# EAGLE design Board_2 (EAGLE 9.0.1)
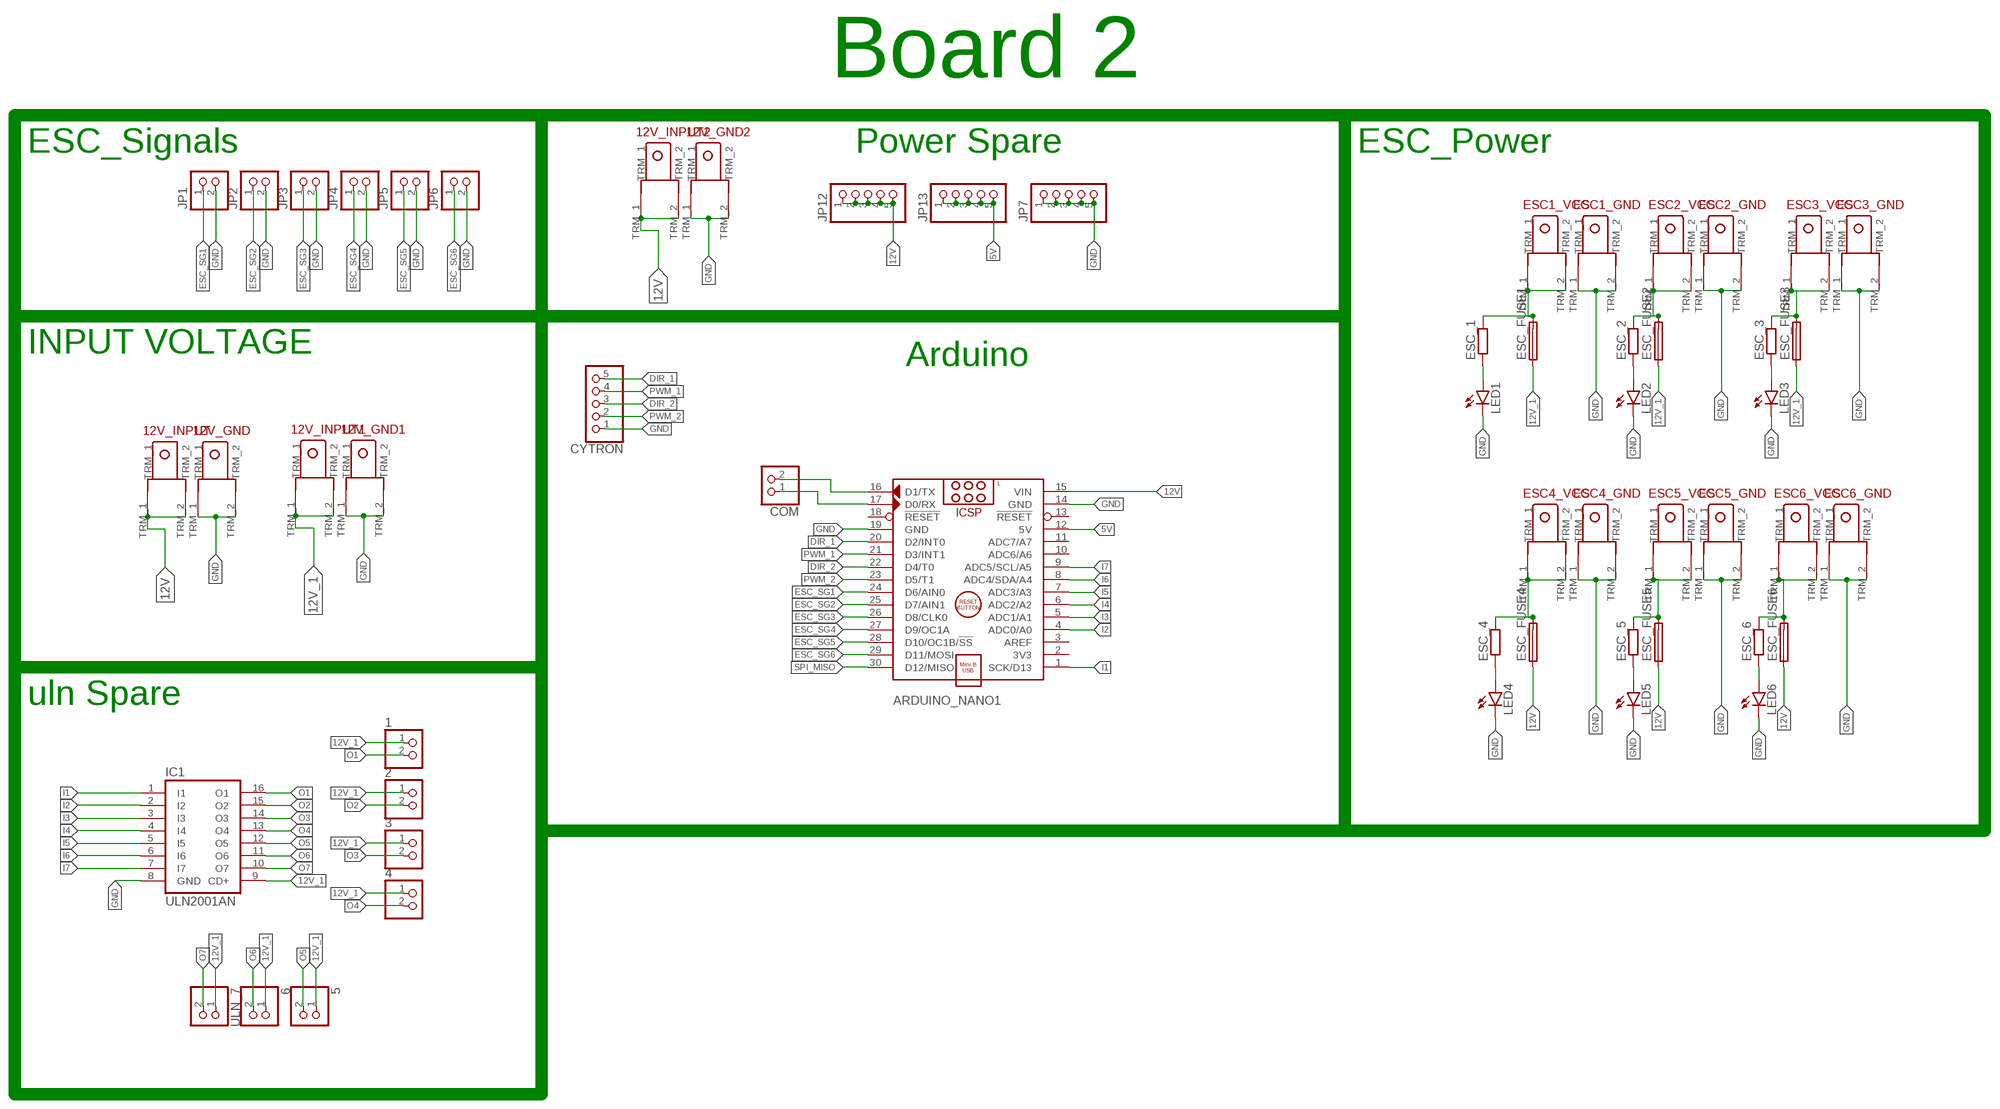
[diagram p0: schematic, sheet 1]

## Parts
1  PINHD-1X2  [1X02]
2  PINHD-1X2  [1X02]
3  PINHD-1X2  [1X02]
4  PINHD-1X2  [1X02]
5  PINHD-1X2  [1X02]
6  PINHD-1X2  [1X02]
12V_GND  TERMINAL_EDITED  [TERMINAL_EDITED]
12V_GND1  TERMINAL_EDITED  [TERMINAL_EDITED]
12V_GND2  TERMINAL_EDITED  [TERMINAL_EDITED]
12V_INPUT  TERMINAL_EDITED  [TERMINAL_EDITED]
12V_INPUT1  TERMINAL_EDITED  [TERMINAL_EDITED]
12V_INPUT2  TERMINAL_EDITED  [TERMINAL_EDITED]
ARDUINO_NANO1  ARDUINO_NANO  [ARDUINO_NANO]
COM  PINHD-1X2  [1X02]
CYTRON  PINHD-1X5  [1X05]
ESC1_GND  TERMINAL_EDITED  [TERMINAL_EDITED]
ESC1_VCC  TERMINAL_EDITED  [TERMINAL_EDITED]
ESC2_GND  TERMINAL_EDITED  [TERMINAL_EDITED]
ESC2_VCC  TERMINAL_EDITED  [TERMINAL_EDITED]
ESC3_GND  TERMINAL_EDITED  [TERMINAL_EDITED]
ESC3_VCC  TERMINAL_EDITED  [TERMINAL_EDITED]
ESC4_GND  TERMINAL_EDITED  [TERMINAL_EDITED]
ESC4_VCC  TERMINAL_EDITED  [TERMINAL_EDITED]
ESC5_GND  TERMINAL_EDITED  [TERMINAL_EDITED]
ESC5_VCC  TERMINAL_EDITED  [TERMINAL_EDITED]
ESC6_GND  TERMINAL_EDITED  [TERMINAL_EDITED]
ESC6_VCC  TERMINAL_EDITED  [TERMINAL_EDITED]
ESC_1  RESISTOR  [0207/10]
ESC_2  RESISTOR  [0207/10]
ESC_3  RESISTOR  [0207/10]
ESC_4  RESISTOR  [0207/10]
ESC_5  RESISTOR  [0207/10]
ESC_6  RESISTOR  [0207/10]
ESC_FUSE1  FUSE  [SH22,5A]
ESC_FUSE2  FUSE  [SH22,5A]
ESC_FUSE3  FUSE  [SH22,5A]
ESC_FUSE4  FUSE  [SH22,5A]
ESC_FUSE5  FUSE  [SH22,5A]
ESC_FUSE6  FUSE  [SH22,5A]
IC1  ULN2001AN  [DIL16]
JP1  PINHD-1X2  [1X02]
JP2  PINHD-1X2  [1X02]
JP3  PINHD-1X2  [1X02]
JP4  PINHD-1X2  [1X02]
JP5  PINHD-1X2  [1X02]
JP6  PINHD-1X2  [1X02]
JP7  PINHD-1X5  [1X05]
JP12  PINHD-1X5  [1X05]
JP13  PINHD-1X5  [1X05]
LED1  LED5MM  [LED5MM]
LED2  LED5MM  [LED5MM]
LED3  LED5MM  [LED5MM]
LED4  LED5MM  [LED5MM]
LED5  LED5MM  [LED5MM]
LED6  LED5MM  [LED5MM]
ULN_7  PINHD-1X2  [1X02]

## Nets
5V: ARDUINO_NANO1.12(5V) JP13.1 JP13.2 JP13.3 JP13.4 JP13.5
12V: 12V_INPUT2.TRM_1 12V_INPUT2.TRM_2 12V_INPUT.TRM_1 12V_INPUT.TRM_2 ARDUINO_NANO1.15(VIN) ESC_FUSE4.1 ESC_FUSE5.1 ESC_FUSE6.1 JP12.1 JP12.2 JP12.3 JP12.4 JP12.5
12V_1: 1.1 2.1 3.1 4.1 5.1 6.1 12V_INPUT1.TRM_1 12V_INPUT1.TRM_2 ESC_FUSE1.1 ESC_FUSE2.1 ESC_FUSE3.1 IC1.9(CD+) ULN_7.1
DIR_1: ARDUINO_NANO1.20(D2/INT0) CYTRON.5
DIR_2: ARDUINO_NANO1.22(D4/T0) CYTRON.3
ESC_SG1: ARDUINO_NANO1.24(D6/AIN0) JP1.1
ESC_SG2: ARDUINO_NANO1.25(D7/AIN1) JP2.1
ESC_SG3: ARDUINO_NANO1.26(D8/CLK0) JP3.1
ESC_SG4: ARDUINO_NANO1.27(D9/OC1A) JP4.1
ESC_SG5: ARDUINO_NANO1.28(D10/OC1B/!SS) JP5.1
ESC_SG6: ARDUINO_NANO1.29(D11/MOSI) JP6.1
GND: 12V_GND1.TRM_1 12V_GND1.TRM_2 12V_GND2.TRM_1 12V_GND2.TRM_2 12V_GND.TRM_1 12V_GND.TRM_2 ARDUINO_NANO1.14(GND) ARDUINO_NANO1.19(GND) CYTRON.1 ESC1_GND.TRM_1 ESC1_GND.TRM_2 ESC2_GND.TRM_1 ESC2_GND.TRM_2 ESC3_GND.TRM_1 ESC3_GND.TRM_2 ESC4_GND.TRM_1 ESC4_GND.TRM_2 ESC5_GND.TRM_1 ESC5_GND.TRM_2 ESC6_GND.TRM_1 ESC6_GND.TRM_2 IC1.8(GND) JP1.2 JP2.2 JP3.2 JP4.2 JP5.2 JP6.2 JP7.1 JP7.2 JP7.3 JP7.4 JP7.5 LED1.K(C) LED2.K(C) LED3.K(C) LED4.K(C) LED5.K(C) LED6.K(C)
I1: ARDUINO_NANO1.1(SCK/D13) IC1.1(I1)
I2: ARDUINO_NANO1.4(ADC0/A0) IC1.2(I2)
I3: ARDUINO_NANO1.5(ADC1/A1) IC1.3(I3)
I4: ARDUINO_NANO1.6(ADC2/A2) IC1.4(I4)
I5: ARDUINO_NANO1.7(ADC3/A3) IC1.5(I5)
I6: ARDUINO_NANO1.8(ADC4/SDA/A4) IC1.6(I6)
I7: ARDUINO_NANO1.9(ADC5/SCL/A5) IC1.7(I7)
N$1: ESC1_VCC.TRM_1 ESC1_VCC.TRM_2 ESC_1.2 ESC_FUSE1.2
N$4: ESC2_VCC.TRM_1 ESC2_VCC.TRM_2 ESC_2.2 ESC_FUSE2.2
N$5: ARDUINO_NANO1.17(D0/RX) COM.1
N$6: ARDUINO_NANO1.16(D1/TX) COM.2
N$7: ESC3_VCC.TRM_1 ESC3_VCC.TRM_2 ESC_3.2 ESC_FUSE3.2
N$10: ESC4_VCC.TRM_1 ESC4_VCC.TRM_2 ESC_4.2 ESC_FUSE4.2
N$11: ESC_1.1 LED1.A
N$13: ESC5_VCC.TRM_1 ESC5_VCC.TRM_2 ESC_5.2 ESC_FUSE5.2
N$14: ESC_2.1 LED2.A
N$16: ESC6_VCC.TRM_1 ESC6_VCC.TRM_2 ESC_6.2 ESC_FUSE6.2
N$17: ESC_3.1 LED3.A
N$19: ESC_4.1 LED4.A
N$21: ESC_5.1 LED5.A
N$23: ESC_6.1 LED6.A
O1: 1.2 IC1.16(O1)
O2: 2.2 IC1.15(O2)
O3: 3.2 IC1.14(O3)
O4: 4.2 IC1.13(O4)
O5: 5.2 IC1.12(O5)
O6: 6.2 IC1.11(O6)
O7: IC1.10(O7) ULN_7.2
PWM_1: ARDUINO_NANO1.21(D3/INT1) CYTRON.4
PWM_2: ARDUINO_NANO1.23(D5/T1) CYTRON.2
SPI_MISO: ARDUINO_NANO1.30(D12/MISO)
Unconnected: ARDUINO_NANO1.2(3V3) ARDUINO_NANO1.3(AREF) ARDUINO_NANO1.10(ADC6/A6) ARDUINO_NANO1.11(ADC7/A7) ARDUINO_NANO1.13(!RESET) ARDUINO_NANO1.18(!RESET)

## Notes on the sheet
- Board 2
- ESC_Signals | Power Spare | ESC_Power
- INPUT VOLTAGE
- Arduino
- uln Spare

## Library data of the parts
1-6 COM JP1-JP6 ULN_7 = pinhead:PINHD-1X2: PIN HEADER
12V_GND 12V_GND1 12V_GND2 12V_INPUT 12V_INPUT1 12V_INPUT2 ESC1_GND ESC1_VCC ESC2_GND ESC2_VCC ESC3_GND ESC3_VCC ESC4_GND ESC4_VCC ESC5_GND ESC5_VCC ESC6_GND ESC6_VCC = 1-ROV Components:TERMINAL_EDITED
ARDUINO_NANO1 = 1-ROV Components:ARDUINO_NANO: Arduino Nano V3.0 Module Overview: The Arduino Nano is a small, complete, and breadboard-friendly board based on the ATmega328 (Arduino Nano 3.x) or ATmega168 (Arduino Nano 2.x). It has more or less the same functionality of the Arduino Duemilanove, but in a different package. It lacks only a DC power jack, and works with a Mini-B USB cable instead of a standard one. The Nano was designed and is being produced by Gravitech <http://www.gravitech.us/arna30wiatp.html>. General specifications: Item Value Microcontroller Atmel ATmega168 or ATmega328 Operating Voltage (logic level) 5 V Input Voltage (recommended) 7-12 V Input Voltage (limits) 6-20 V Digital I/O Pins 14 (of which 6 provide PWM output) Analog Input Pins 8 DC Current per I/O Pin 40 mA Flash Memory 16 KB (ATmega168) or 32 KB (ATmega328) of which 2 KB used by bootloader SRAM 1 KB (ATmega168) or 2 KB (ATmega328) EEPROM 512 bytes (ATmega168) or 1 KB (ATmega328) Clock Speed 16 MHz Dimensions (Inches) 0.73" x 1.70" Dimensions (mm) 18mm x 45mm Overall height About 9 mm (not including pins) Weigth 5 g Power: The Arduino Nano can be powered via the Mini-B USB connection, 6-20V unregulated external power supply (pin 30), or 5V regulated external power supply (pin 27). The power source is automatically selected to the highest voltage source. Memory: The ATmega168 has 16 KB of flash memory for storing code (of which 2 KB is used for the bootloader); the ATmega328 has 32 KB, (also with 2 KB used for the bootloader). The ATmega168 has 1 KB of SRAM and 512 bytes of EEPROM (which can be read and written with the EEPROM library); the ATmega328 has 2 KB of SRAM and 1 KB of EEPROM. Input and Output: Each of the 14 digital pins on the Nano can be used as an input or output, using pinMode(), digitalWrite(), and digitalRead() functions. They operate at 5 volts. Each pin can provide or receive a maximum of 40 mA and has an internal pull-up resistor (disconnected by default) of 20-50 kOhms. In addition, some pins have specialized functions. Visit Arduino - ArduinoBoardNano <https://www.arduino.cc/en/Main/ArduinoBoardNano>
CYTRON JP7 JP12 JP13 = pinhead:PINHD-1X5: PIN HEADER
ESC_1-ESC_6 = 1-ROV Components:RESISTOR
ESC_FUSE1-ESC_FUSE6 = 1-ROV Components:FUSE
IC1 = uln-udn:ULN2001A: DRIVER ARRAY
LED1-LED6 = led:LED: LED OSRAM: - CHIPLED LG R971, LG N971, LY N971, LG Q971, LY Q971, LO R971, LY R971 LH N974, LH R974 LS Q976, LO Q976, LY Q976 LO Q996 - Hyper CHIPLED LW Q18S LB Q993, LB Q99A, LB R99A - SideLED LS A670, LO A670, LY A670, LG A670, LP A670 LB A673, LV A673, LT A673, LW A673 LH A674 LY A675 LS A676, LA A676, LO A676, LY A676, LW A676 LS A679, LY A679, LG A679 - Hyper Micro SIDELED® LS Y876, LA Y876, LO Y876, LY Y876 LT Y87S - SmartLED LW L88C, LW L88S LB L89C, LB L89S, LG L890 LS L89K, LO L89K, LY L89K LS L896, LA L896, LO L896, LY L896 - TOPLED LS T670, LO T670, LY T670, LG T670, LP T670 LSG T670, LSP T670, LSY T670, LOP T670, LYG T670 LG T671, LOG T671, LSG T671 LB T673, LV T673, LT T673, LW T673 LH T674 LS T676, LA T676, LO T676, LY T676, LB T676, LH T676, LSB T676, LW T676 LB T67C, LV T67C, LT T67C, LS T67K, LO T67K, LY T67K, LW E67C LS E67B, LA E67B, LO E67B, LY E67B, LB E67C, LV E67C, LT E67C LW T67C LS T679, LY T679, LG T679 LS T770, LO T770, LY T770, LG T770, LP T770 LB T773, LV T773, LT T773, LW T773 LH T774 LS E675, LA E675, LY E675, LS T675 LS T776, LA T776, LO T776, LY T776, LB T776 LHGB T686 LT T68C, LB T68C - Hyper Mini TOPLED® LB M676 - Mini TOPLED Santana® LG M470 LS M47K, LO M47K, LY M47K Source: http://www.osram.convergy.de LUXEON: - LUMILED® LXK2-PW12-R00, LXK2-PW12-S00, LXK2-PW14-U00, LXK2-PW14-V00 LXK2-PM12-R00, LXK2-PM12-S00, LXK2-PM14-U00 LXK2-PE12-Q00, LXK2-PE12-R00, LXK2-PE12-S00, LXK2-PE14-T00, LXK2-PE14-U00 LXK2-PB12-K00, LXK2-PB12-L00, LXK2-PB12-M00, LXK2-PB14-N00, LXK2-PB14-P00, LXK2-PB14-Q00 LXK2-PR12-L00, LXK2-PR12-M00, LXK2-PR14-Q00, LXK2-PR14-R00 LXK2-PD12-Q00, LXK2-PD12-R00, LXK2-PD12-S00 LXK2-PH12-R00, LXK2-PH12-S00 LXK2-PL12-P00, LXK2-PL12-Q00, LXK2-PL12-R00 Source: www.luxeon.com KINGBRIGHT: KA-3528ASYC Source: www.kingbright.com

## Board
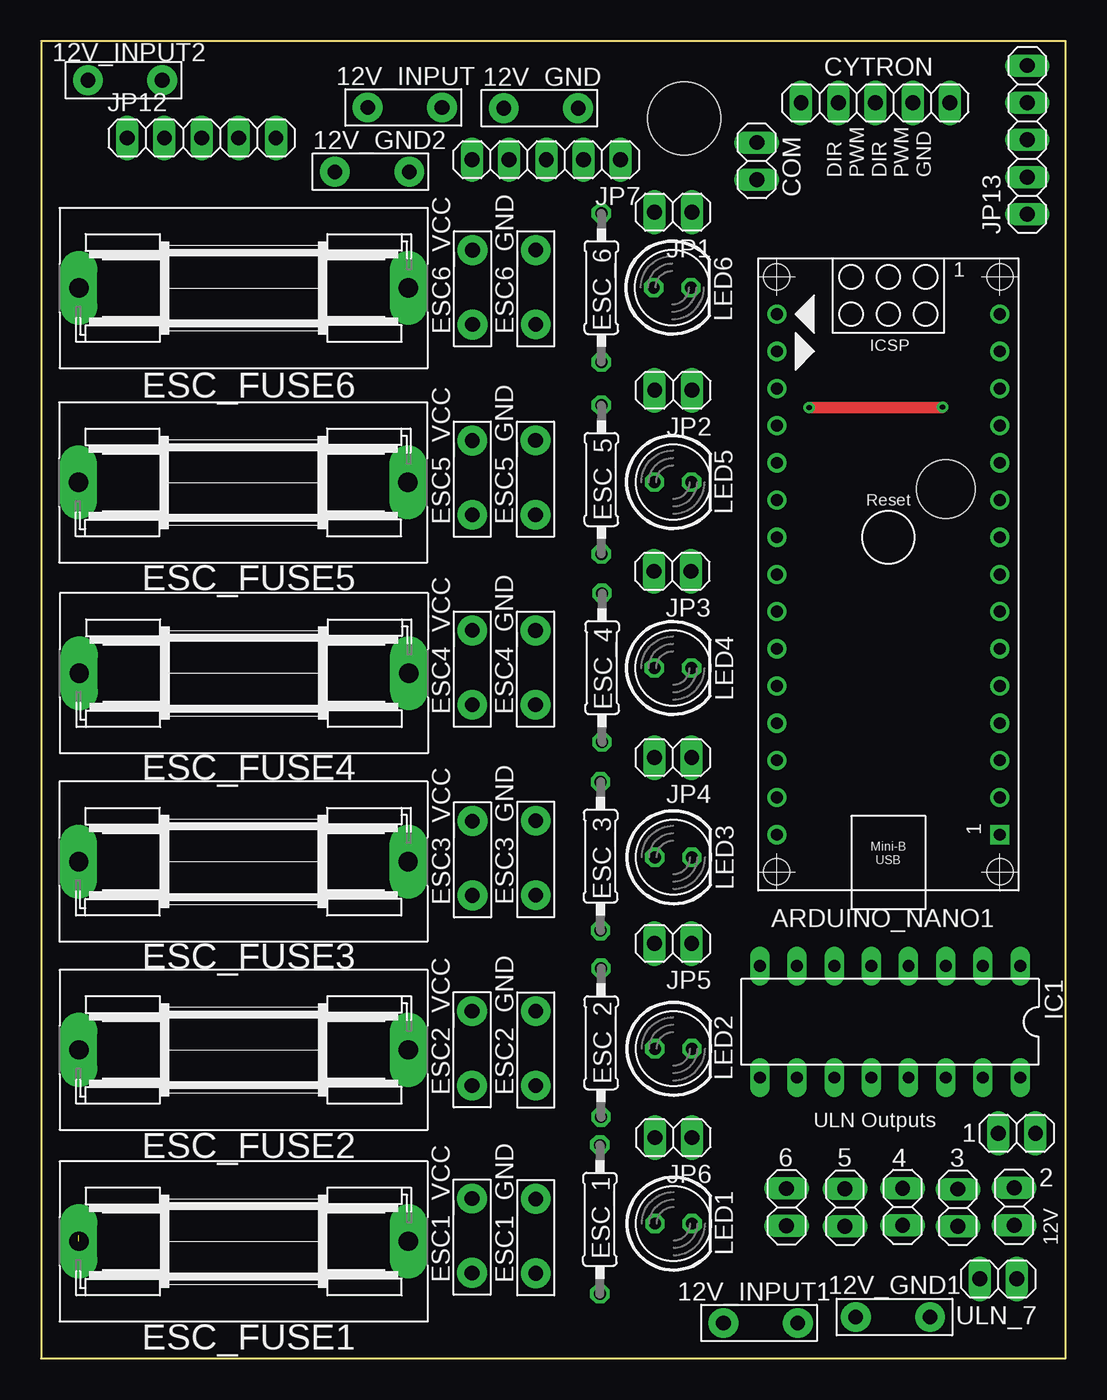
[diagram p1: board, top side]
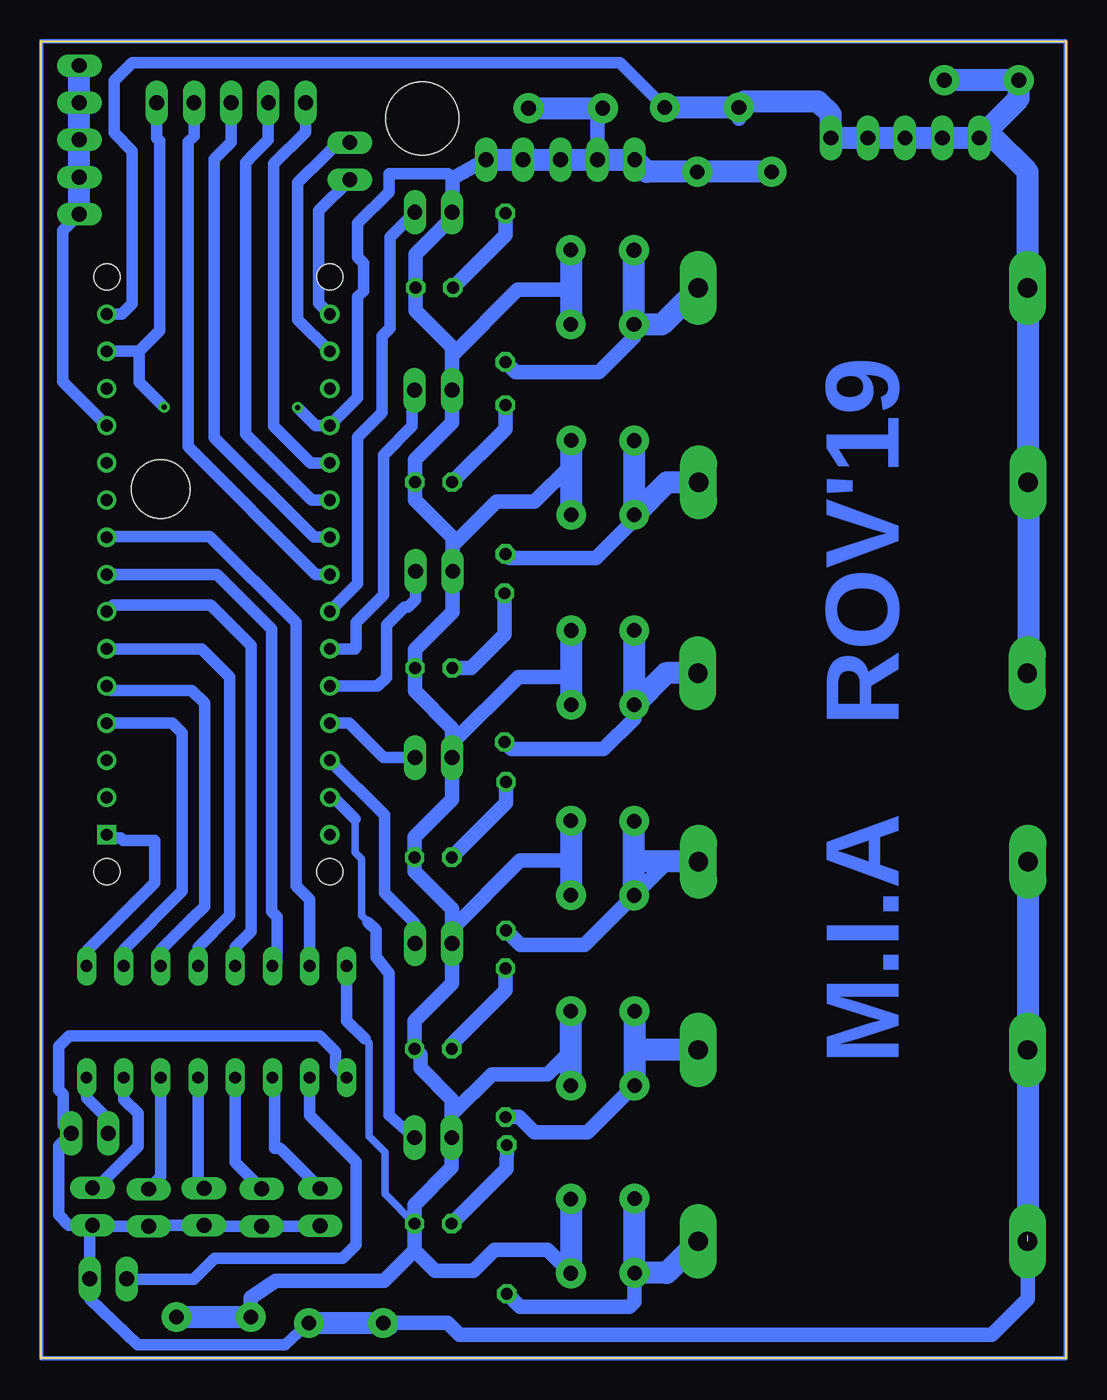
[diagram p2: board, bottom side, seen from below]

Size 70 x 90 mm. Coordinates in mm from the lower left corner, seen from the top.
Outline: 0,0 70,0 70,90 0,90 0,0
Copper layers (1*16): Top 0.035mm / dielectric 1.5mm / Bottom 0.035mm
Design rules "default": minimum track width 6mil, minimum drill 0.35mm, track to track 6mil, track to pad 6mil, pad to pad 6mil, via to via 6mil, smd to smd 6mil, copper to edge 40mil, drill to drill 6mil, minimum pad ring 10mil, minimum via ring 8mil, stop-mask expansion 4mil, vias tented up to drill 0mil, thermal gap 10mil
Holes 5 mm at 43.94,84.71
Holes 4 mm at 61.82,59.39

### Footprints (pad centres in the part's own frame; a part is rotated, then mirrored left to right if it is on the bottom)
1X02 = drill 1.016 long: 1 -1.27,0; 2 1.27,0
TERMINAL_EDITED = drill 1 pad 2.032: TRM_1 -2.54,0; TRM_2 2.54,0
ARDUINO_NANO = drill 0.8 square: 1 -20.32,-7.62 | drill 0.8: 2 -17.78,-7.62; 3 -15.24,-7.62; 4 -12.7,-7.62; 5 -10.16,-7.62; 6 -7.62,-7.62; 7 -5.08,-7.62; 8 -2.54,-7.62; 9 0,-7.62; 10 2.54,-7.62; 11 5.08,-7.62; 12 7.62,-7.62; 13 10.16,-7.62; 14 12.7,-7.62; 15 15.24,-7.62; 16 15.24,7.62; 17 12.7,7.62; 18 10.16,7.62; 19 7.62,7.62; 20 5.08,7.62; 21 2.54,7.62; 22 0,7.62; 23 -2.54,7.62; 24 -5.08,7.62; 25 -7.62,7.62; 26 -10.16,7.62; 27 -12.7,7.62; 28 -15.24,7.62; 29 -17.78,7.62; 30 -20.32,7.62 | hole 1.778: -22.86,-7.62; -22.86,7.62; 17.78,7.62; 17.78,-7.62
1X05 = drill 1.016 long: 1 -5.08,0; 2 -2.54,0; 3 0,0; 4 2.54,0; 5 5.08,0
0207/10 = drill 0.813 octagon: 1 -5.08,0; 2 5.08,0
SH22,5A = drill 1.321 pad 2.54 long: 1 -11.252,0; 2 11.252,0
DIL16 = drill 0.813 long: 1 -8.89,-3.81; 2 -6.35,-3.81; 3 -3.81,-3.81; 4 -1.27,-3.81; 5 1.27,-3.81; 6 3.81,-3.81; 7 6.35,-3.81; 8 8.89,-3.81; 9 8.89,3.81; 10 6.35,3.81; 11 3.81,3.81; 12 1.27,3.81; 13 -1.27,3.81; 14 -3.81,3.81; 15 -6.35,3.81; 16 -8.89,3.81
LED5MM = drill 0.813 octagon: A -1.27,0; K 1.27,0

### Placement (x,y rotation side)
1  66.67,15.39 180 top
2  66.48,10.38 90 top
3  62.64,10.3 90 top
4  58.87,10.36 90 top
5  54.93,10.31 90 top
6  50.94,10.34 90 top
12V_GND  34.15,85.41 0 top
12V_GND1  58.2,2.83 180 top
12V_GND2  22.62,81.07 0 top
12V_INPUT  24.86,85.46 0 top
12V_INPUT1  49.16,2.43 0 top
12V_INPUT2  5.74,87.32 0 top
ARDUINO_NANO1  57.89,56.1 90 top
COM  48.9,81.8 270 top
CYTRON  57.01,85.77 180 top
ESC1_GND  33.8,8.36 90 top
ESC1_VCC  29.45,8.39 90 top
ESC2_GND  33.8,21.18 90 top
ESC2_VCC  29.45,21.19 90 top
ESC3_GND  33.8,34.2 90 top
ESC3_VCC  29.48,34.17 90 top
ESC4_GND  33.78,47.19 90 top
ESC4_VCC  29.47,47.2 90 top
ESC5_GND  33.78,60.17 90 top
ESC5_VCC  29.47,60.17 90 top
ESC6_GND  33.81,73.18 90 top
ESC6_VCC  29.49,73.17 90 top
ESC_1  38.18,9.5 270 top
ESC_2  38.26,21.57 270 top
ESC_3  38.23,34.32 270 top
ESC_4  38.33,47.19 270 top
ESC_5  38.28,60.05 270 top
ESC_6  38.28,73.15 270 top
ESC_FUSE1  13.84,8 0 top
ESC_FUSE2  13.84,21.08 0 top
ESC_FUSE3  13.83,33.94 0 top
ESC_FUSE4  13.87,46.81 0 top
ESC_FUSE5  13.82,59.84 0 top
ESC_FUSE6  13.84,73.13 0 top
IC1  58,23 180 top
JP1  43.19,78.31 180 top
JP2  43.2,66.14 180 top
JP3  43.14,53.77 180 top
JP4  43.18,41.05 180 top
JP5  43.18,28.35 180 top
JP6  43.21,15.09 180 top
JP7  34.52,81.89 180 top
JP12  10.97,83.37 0 top
JP13  67.38,83.25 90 top
LED1  43.21,9.21 0 top
LED2  43.21,21.16 0 top
LED3  43.21,34.24 0 top
LED4  43.17,47.17 0 top
LED5  43.18,59.87 0 top
LED6  43.13,73.15 0 top
ULN_7  65.4,5.43 180 top

### Tracks (layer width: path | path; a pad name or v marks a point on that pad's centre or on a via)
5V
  Bottom 0.8: ARDUINO_NANO1.12 68.51,66.72 68.51,77.04 JP13.1
  Bottom 1: JP13.1 JP13.2 JP13.3 | 67.44,82.65 67.28,82.49 JP13.3 | JP13.3 JP13.4 67.38,88.16 JP13.5
  Bottom 1.5: JP13.1 67.38,88.16
12V
  Bottom 0.8: ARDUINO_NANO1.15 64.47,71.34 63.75,72.06 63.75,82.47 65,83.72 65,87.3 63.78,88.52 30.45,88.52 12V_INPUT.TRM_2
  Bottom 1: 2.59,60 2.59,58.41 | 2.59,58.41 3,58 | 2.59,58.41 2.56,58.44 ESC_FUSE5.1 | 2.56,46.86 ESC_FUSE4.1 | 22.07,85.71 12V_INPUT.TRM_1 22.32,84.69
  Bottom 1.5: 12V_INPUT.TRM_2 12V_INPUT.TRM_1 21.93,85.85 16.92,85.85 16.05,84.98 JP12.5 JP12.4 JP12.3 JP12.2 JP12.1 | 2.59,60 ESC_FUSE6.1 2.59,81.06 4.9,83.37 JP12.1 | ESC_FUSE5.1 2.56,46.86 | JP12.1 3.2,86.06 12V_INPUT2.TRM_1 12V_INPUT2.TRM_2
12V_1  (1 unrouted)
  Bottom 0.8: 6.1 50.96,9.04 5.1 58.81,9.04 4.1 62.58,9.09 3.1 66.41,9.03 | 66.41,9.03 2.1 68.09,9.11 68.78,9.8 68.78,14.54 1.1 68.48,15.93 68.48,18.03 68.78,18.34 68.78,21.34 68.07,22.05 50.98,22.05 49.89,20.95 49.89,19.97 IC1.9 | 66.41,9.03 66.67,8.76 ULN_7.1 66.67,4.09 63.4,0.94 53.32,0.94 51.91,2.22
  Bottom 1: 51.91,2.22 12V_INPUT1.TRM_2 | 46.11,2.11 46.43,2.43 | ESC_FUSE1.1 2.59,4.06 5.03,1.63 41.4,1.63 42.21,2.43 12V_INPUT1.TRM_1 | 2.59,8.41 3,8
  Bottom 1.5: 12V_INPUT1.TRM_2 12V_INPUT1.TRM_1 46.43,2.43 | ESC_FUSE3.1 2.58,21.1 ESC_FUSE2.1 ESC_FUSE1.1
DIR_1
  Bottom 0.8: ARDUINO_NANO1.20 51.58,61.18 54.1,63.7 54.1,81.61 51.93,83.78 CYTRON.5
DIR_2
  Bottom 0.8: ARDUINO_NANO1.22 51.35,56.1 58.17,62.92 58.17,81.94 57.01,83.1 CYTRON.3
ESC_SG1
  Bottom 0.8: ARDUINO_NANO1.24 48.36,52.93 48.36,54 48.36,54.74 48.36,62.94 46.69,64.62 46.69,69.85 46.15,70.38 46.15,76.61 JP1.1
ESC_SG2
  Bottom 0.8: ARDUINO_NANO1.25 48.55,48.48 48.46,48.56 48.46,50.29 46.61,52.15 46.61,61.72 44.65,63.68 44.65,65.95 JP2.1
ESC_SG3
  Bottom 0.8: ARDUINO_NANO1.26 47,45.94 46.41,46.53 46.41,50.09 45.16,51.33 44.91,51.33 44.41,51.83 JP3.1
ESC_SG4
  Bottom 0.8: JP4.1 46.58,41.05 48.94,43.4 ARDUINO_NANO1.27
ESC_SG5
  Bottom 0.8: JP5.1 44.45,29.72 46.53,31.8 46.53,37.12 ARDUINO_NANO1.28
ESC_SG6
  Bottom 0.508: 47.65,29.79 48.11,30.25 48.11,34.13 48.54,34.56 48.54,36.85
  Bottom 0.8: JP6.1 46.23,16.61 46.23,26.31 47.12,27.43 47.12,29.26 47.65,29.79 | ARDUINO_NANO1.29 50,38.32 48.54,36.85
GND  (via drill 0.35)
  Top 0.8: v52.48,64.95 61.54,64.95 v61.59,65
  Bottom 0.508: 47.85,21.82 47.6,21.57 47.6,15.16 46.51,14.07 46.51,11.24 LED1.K
  Bottom 0.8: 41.87,80.62 42.17,80.92 46.23,80.92 46.23,79.68 48.36,77.55 48.36,75.23 47.97,74.83 47.97,72.92 48.36,72.53 48.36,65.63 ARDUINO_NANO1.19 51.25,63.72 v52.48,64.95 | IC1.8 49.11,23.07 47.85,21.82 | ARDUINO_NANO1.14 63.3,68.8 | 63.3,68.8 61.9,70.21 61.9,83.19 62.09,83.38 CYTRON.1 | v61.59,65 63.3,66.71 63.3,68.8
  Bottom 1: ESC2_GND.TRM_1 33.8,21.01 | 33.8,21.01 ESC2_GND.TRM_2 | ESC1_GND.TRM_1 35.4,7.42 39.01,7.42 40.44,5.99 43.08,5.99 44.48,7.4 | 44.48,7.4 LED1.K 44.48,10.51 41.94,13.06 JP6.2 41.94,16.66 | 33.8,21.01 35.4,19.41 39.19,19.41 41.94,16.66 | 41.94,16.66 41.94,17.7 44.07,19.84 44.07,20.75 LED2.K 44.48,23.06 41.91,25.63 JP5.2 | ESC3_GND.TRM_2 33.8,34.01 | 33.8,34.01 ESC3_GND.TRM_1 | 33.8,34.01 37.26,34.01 41.91,29.36 JP5.2 | JP5.2 41.91,30.71 44.48,33.27 LED3.K 44.48,35.64 41.91,38.2 JP4.2 | ESC4_GND.TRM_2 33.78,47 | 33.78,47 ESC4_GND.TRM_1 | 33.78,47 34.22,46.56 37.39,46.56 41.91,42.04 JP4.2 | JP4.2 41.91,43.05 44.44,45.59 LED4.K 44.44,48.42 41.87,50.99 JP3.2 | ESC5_GND.TRM_2 33.78,61.01 | 33.78,61.01 ESC5_GND.TRM_1 | 33.78,61.01 36.27,58.52 38.89,58.52 41.87,55.54 JP3.2 | JP3.2 41.87,56.07 44.45,58.65 LED5.K 44.45,61.42 41.93,63.94 JP2.2 | ESC6_GND.TRM_2 33.81,73 | 33.81,73 ESC6_GND.TRM_1 | 33.81,73 37.44,73 41.93,68.51 JP2.2 | JP2.2 41.93,69.1 44.4,71.58 LED6.K 44.4,75.44 41.87,77.97 JP1.2 41.87,80.62 JP7.1 JP7.2 JP7.3 JP7.4 | JP7.4 JP7.5 | 12V_GND.TRM_1 31.98,85.05 JP7.4 | 12V_GND1.TRM_2 55.66,4.15 53.97,5.31 46.57,5.31 44.48,7.4
  Bottom 1.5: 12V_GND.TRM_2 12V_GND.TRM_1 | JP7.1 JP7.5 28.62,81.07 12V_GND2.TRM_2 12V_GND2.TRM_1 | ESC1_GND.TRM_2 ESC1_GND.TRM_1 | ESC2_GND.TRM_1 ESC2_GND.TRM_2 | ESC3_GND.TRM_2 ESC3_GND.TRM_1 | ESC4_GND.TRM_2 ESC4_GND.TRM_1 | ESC5_GND.TRM_2 ESC5_GND.TRM_1 | ESC6_GND.TRM_2 ESC6_GND.TRM_1 | 12V_GND1.TRM_2 12V_GND1.TRM_1
I1
  Bottom 0.8: IC1.1 66.89,27.83 62.23,32.49 62.23,35.38 64.39,35.38 64.56,35.55 65.28,35.55 ARDUINO_NANO1.1
I2
  Bottom 0.8: IC1.2 64.35,27.93 60.35,31.93 60.35,42.72 61.03,43.4 ARDUINO_NANO1.4
I3
  Bottom 0.8: IC1.3 61.81,27.9 59.77,29.95 58.83,30.89 58.83,31.06 58.83,44.78 59.69,45.64 65.21,45.64 ARDUINO_NANO1.5
I4
  Bottom 0.8: IC1.4 59.27,28.08 57.1,30.25 57.1,46.56 59.02,48.48 ARDUINO_NANO1.6
I5
  Bottom 0.8: IC1.5 56.73,28.08 55.65,29.16 55.65,48.72 58.4,51.46 65.07,51.46 ARDUINO_NANO1.7
I6
  Bottom 0.8: IC1.6 54.2,26.82 53.87,27.15 53.87,30.15 54.25,30.53 54.25,49.84 57.98,53.56 ARDUINO_NANO1.8
I7
  Bottom 0.8: IC1.7 51.65,31.36 52.58,32.28 52.58,50.26 58.47,56.16 65.45,56.16 ARDUINO_NANO1.9
N$1
  Bottom 1: ESC1_VCC.TRM_1 29.45,3.88 29.79,3.53 37.29,3.53 ESC_1.2
  Bottom 1.5: ESC1_VCC.TRM_2 ESC1_VCC.TRM_1 27.25,5.85 ESC_FUSE1.2
N$2
  Bottom 0.3: 0,0 70,0 70,90 0,90 0,0
N$4
  Bottom 1: ESC_2.2 37.35,16.49 36.3,15.44 32.66,15.44 ESC2_VCC.TRM_1 29.45,20.45 | 29.45,20.45 29.45,21 | ESC_FUSE2.2 28.82,21.08 29.45,20.45
  Bottom 1.5: ESC2_VCC.TRM_2 29.45,21 | 29.45,21 ESC2_VCC.TRM_1 | ESC_FUSE2.2 29.37,21.08 29.45,21
N$5
  Bottom 0.8: ARDUINO_NANO1.17 52.45,70.98 52.45,80.31 50.57,82.19 50.55,82.19 49.67,83.07 COM.1
N$6
  Bottom 0.8: ARDUINO_NANO1.16 51.03,72.1 51.03,78.4 COM.2
N$7
  Bottom 1: ESC_FUSE3.2 27.17,33.94 ESC3_VCC.TRM_1 32.87,28.25 37.24,28.25 ESC_3.2
  Bottom 1.5: ESC3_VCC.TRM_1 29.48,34 | 29.48,34 ESC3_VCC.TRM_2 | ESC_FUSE3.2 29.41,33.94 29.48,34
N$10
  Bottom 1: ESC4_VCC.TRM_1 29.47,43.73 31.57,41.63 37.85,41.63 ESC_4.2
  Bottom 1.5: ESC4_VCC.TRM_2 ESC4_VCC.TRM_1 27.32,46.81 ESC_FUSE4.2
N$11
  Bottom 1: ESC_1.1 38.2,12.95 LED1.A
N$13
  Bottom 1: ESC5_VCC.TRM_1 29.47,57.3 32.08,54.69 38,54.69 ESC_5.2
  Bottom 1.5: ESC5_VCC.TRM_2 ESC5_VCC.TRM_1 27.26,59.84 ESC_FUSE5.2
N$14
  Bottom 1: ESC_2.1 38.26,25.14 41.94,21.46 LED2.A
N$16
  Bottom 1: ESC6_VCC.TRM_1 29.48,69.78 31.88,67.39 37.59,67.39 ESC_6.2
  Bottom 1.5: ESC6_VCC.TRM_2 ESC6_VCC.TRM_1 27.59,70.63 ESC_FUSE6.2
N$17
  Bottom 1: ESC_3.1 38.23,37.95 LED3.A
N$19
  Bottom 1: ESC_4.1 38.33,49.45 40.62,47.17 LED4.A
N$21
  Bottom 1: ESC_5.1 38.28,63.5 LED5.A
N$23
  Bottom 1: ESC_6.1 38.28,76.73 LED6.A
O1
  Bottom 0.8: 1.2 65.4,16.33 66.89,17.82 IC1.16
O2
  Bottom 0.8: IC1.15 64.35,17.72 63.37,16.74 63.37,14.48 66.2,11.65 2.2
O3
  Bottom 0.8: 3.2 61.81,12.41 IC1.14
O4
  Bottom 0.8: 4.2 59.27,12.04 IC1.13
O5
  Bottom 0.8: IC1.12 56.73,13.39 5.2
O6
  Bottom 0.8: 6.2 53.68,14.35 54.05,14.35 54.05,19.05 IC1.11
O7
  Bottom 0.8: IC1.10 51.65,16.62 48.46,13.44 48.46,7.77 49.4,6.83 58.14,6.83 59.56,5.41 64.11,5.41 ULN_7.2
PWM_1
  Bottom 0.8: ARDUINO_NANO1.21 51.53,58.64 56.03,63.14 56.03,81.69 55.46,82.26 54.47,83.25 CYTRON.4
PWM_2
  Bottom 0.8: ARDUINO_NANO1.23 51.22,53.56 59.94,62.28 59.94,83.11 59.55,83.5 CYTRON.2

### Text on the board
Bottom: M.I.A ROV'19
tPlace: DIR / PWM / DIR / PWM / GND
tNames: ULN Outputs | 12V